# Altium schematic sheet ZG-Mxx底板MINI-v1.0.SchDoc
size A3; DocumentName: CC2530ZDK-BB
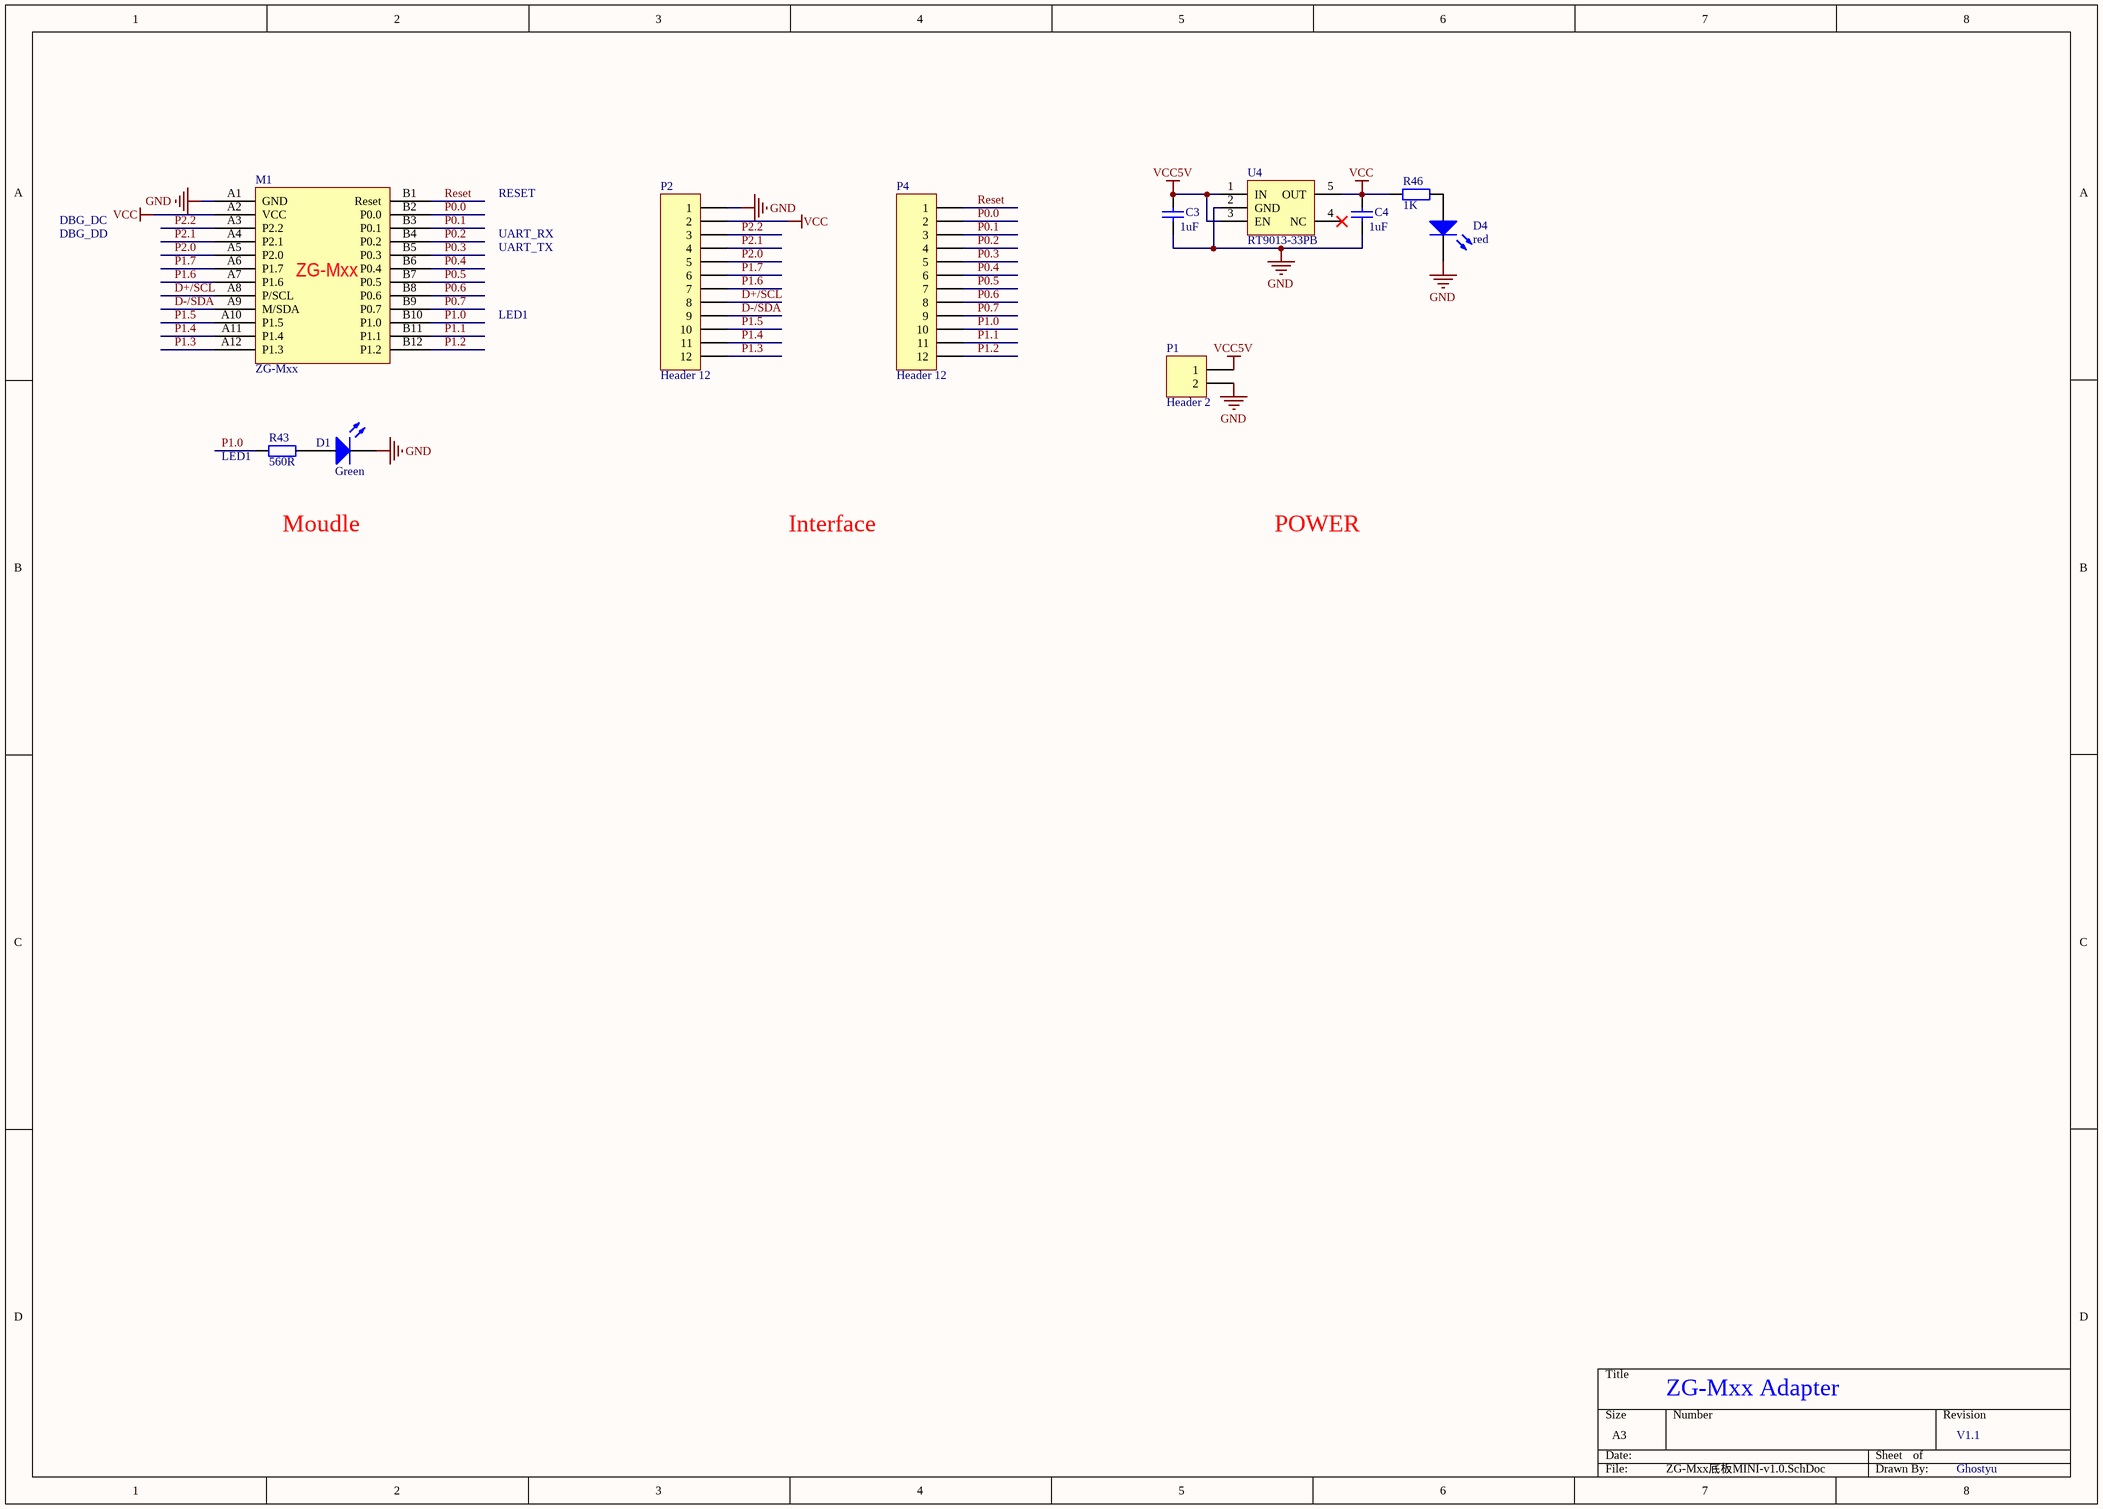
[diagram p0: ZG-Mxx底板MINI-v1.0.SchDoc]

## Parts
C3  value 1uF  [R0603-S]  (hidden comment: Cap)
C4  value 1uF  [R0603-S]  (hidden comment: Cap)
D1  Green  [LED0805]
D4  red  [LED0805]
M1  ZG-Mxx  [ZG-M1/1E]
P1  Header 2  [HDR1X2]
P2  Header 12  [HDR2X6]
P4  Header 12  [HDR2X6]
R43  value 560R  [R0603-S]  (hidden comment: Res2)
R46  value 1K  [R0603-S]  (hidden comment: Res2)
U4  RT9013-33PB  [SOT23-5]

## Nets
GND: C3.2 C4.2 D1.2(K) D4.2(K) M1.A1(GND) P1.2 P2.1 U4.2(GND)
VCC: C4.1 M1.A2(VCC) P2.2 R46.2 U4.5(OUT)
VCC5V: C3.1 P1.1 U4.1(IN) U4.3(EN)
D+/SCL: M1.A8(P/SCL) P2.8
D-/SDA: M1.A9(M/SDA) P2.9
P0.0: M1.B2(P0.0) P4.2
P0.1: M1.B3(P0.1) P4.3
P0.2: M1.B4(P0.2) P4.4
P0.3: M1.B5(P0.3) P4.5
P0.4: M1.B6(P0.4) P4.6
P0.5: M1.B7(P0.5) P4.7
P0.6: M1.B8(P0.6) P4.8
P0.7: M1.B9(P0.7) P4.9
P1.0: M1.B10(P1.0) P4.10 R43.2
P1.1: M1.B11(P1.1) P4.11
P1.2: M1.B12(P1.2) P4.12
P1.3: M1.A12(P1.3) P2.12
P1.4: M1.A11(P1.4) P2.11
P1.5: M1.A10(P1.5) P2.10
P1.6: M1.A7(P1.6) P2.7
P1.7: M1.A6(P1.7) P2.6
P2.0: M1.A5(P2.0) P2.5
P2.1: M1.A4(P2.1) P2.4
P2.2: M1.A3(P2.2) P2.3
Reset: M1.B1(Reset) P4.1
NetD1_1: D1.1(A) R43.1
NetD4_1: D4.1(A) R46.1

Not connected (* = marked no-connect by the designer): U4 4(NC)*

## Notes on the sheet
- DBG_DD
- DBG_DC
- RESET
- UART_RX
- UART_TX
- LED1
- (near R43) LED1
- Moudle
- Interface
- POWER
- ZG-Mxx Adapter
- V1.1
- Ghostyu

## Library data of the parts
C3 C4 = Cap: Capacitor; Published: 8-Jun-2000; LatestRevisionDate: 17-Jul-2002; LatestRevisionNote: Re-released for DXP Platform.; PackageReference: RAD-0.3; Publisher: Altium Limited
D1 D4 = LED2: Typical RED, GREEN, YELLOW, AMBER GaAs LED; Published: 8-Jun-2000; LatestRevisionDate: 17-Jul-2002; LatestRevisionNote: Re-released for DXP Platform.; PackageDocument: Feb-2002; PackageReference: 3.2X1.6X1.1; Publisher: Altium Limited
P1 = Header 2: Header, 2-Pin; LatestRevisionDate: 17-Jul-2002; LatestRevisionNote: Re-released for DXP Platform.; Publisher: Altium Limited
P2 P4 = Header 12: Header, 12-Pin; LatestRevisionDate: 17-Jul-2002; LatestRevisionNote: Re-released for DXP Platform.; Publisher: Altium Limited
R43 R46 = Res2: Resistor; Published: 8-Jun-2000; LatestRevisionDate: 17-Jul-2002; LatestRevisionNote: Re-released for DXP Platform.; PackageReference: AXIAL-0.4; Publisher: Altium Limited